# Altium schematic sheet 3V3.SchDoc
size A; SheetNumber: 2
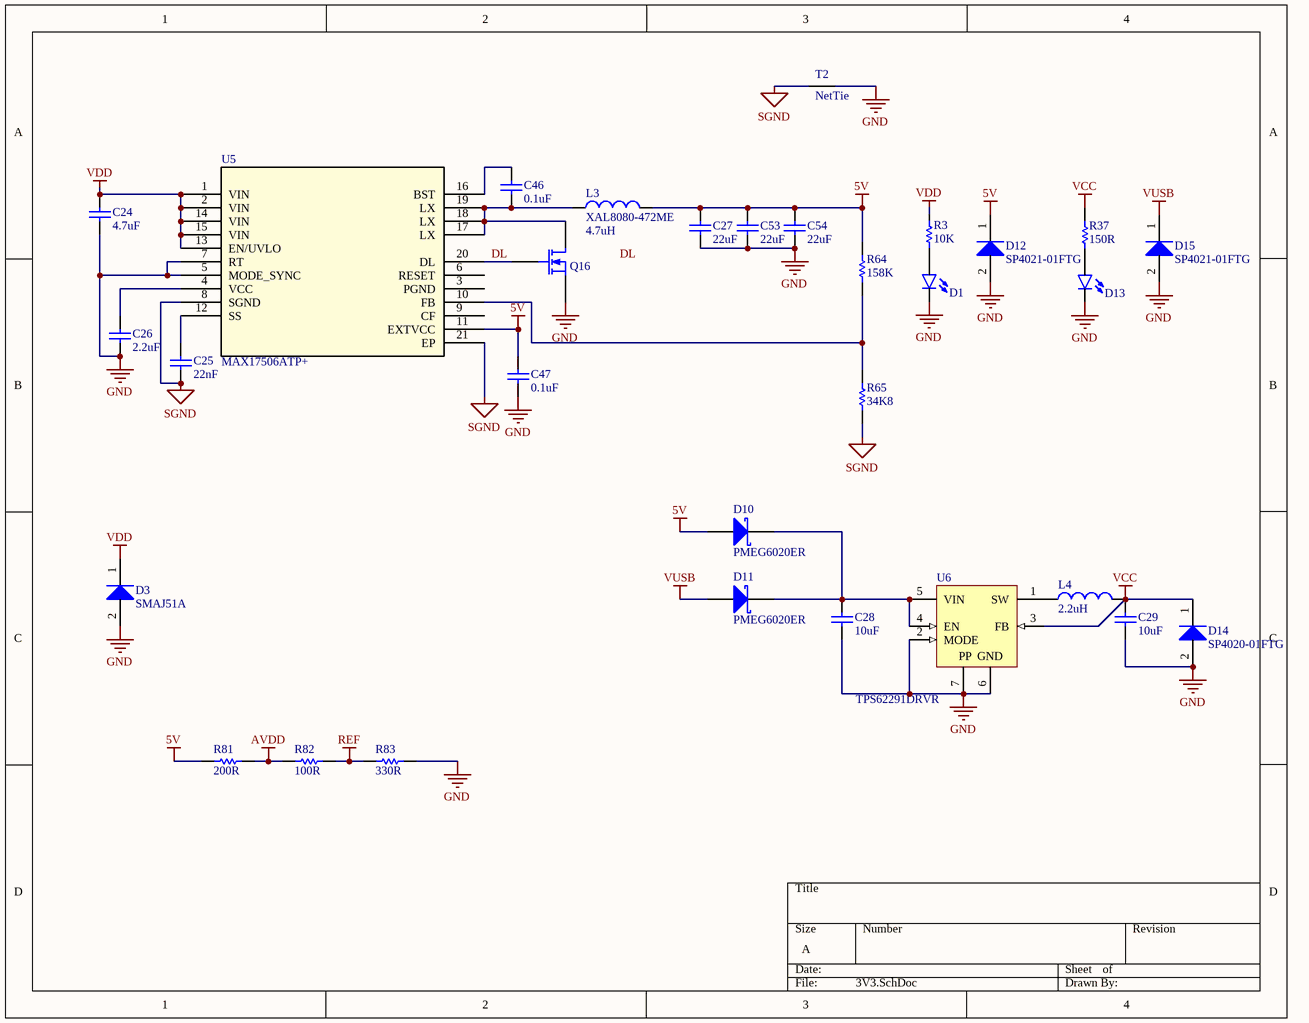
[diagram p0: 3V3.SchDoc]

## Parts
C24  value 4.7uF  [C1210[3225X200]]  (hidden comment: 4.7uF 100V 1210)
C25  value 22nF  [C0603[1608X92]]  (hidden comment: 22nF 50V 0603)
C26  value 2.2uF  [C0603[1608X92]]  (hidden comment: 2.2uF 10V 0603)
C27  value 22uF  [C1210[3225X250]]  (hidden comment: 22uF 16V 1210)
C28  value 10uF  [C0603[1608X92]]  (hidden comment: 10uF 16V 0603)
C29  value 10uF  [C0603[1608X92]]  (hidden comment: 10uF 6.3V 0603)
C46  value 0.1uF  [C0603[1608X92]]  (hidden comment: 0.1uF 16V 0603)
C47  value 0.1uF  [C0603[1608X92]]  (hidden comment: 0.1uF 6.3V 0603)
C53  value 22uF  [C1210[3225X250]]  (hidden comment: 22uF 16V 1210)
C54  value 22uF  [C1210[3225X250]]  (hidden comment: 22uF 16V 1210)
D1  LED_0603_GREEN_5mA  [LED0603]  (value not drawn)
D3  SMAJ51A  [DO-214AC]
D10  PMEG6020ER  [SOD-123]
D11  PMEG6020ER  [SOD-123]
D12  SP4021-01FTG  [SOD-323]
D13  LED_0603_GREEN_5mA  [LED0603]  (value not drawn)
D14  SP4020-01FTG  [SOD-323]
D15  SP4021-01FTG  [SOD-323]
L3  XAL8080-472ME  value 4.7uH  [XAL8080]
L4  2.2uH  [IND0805]
Q16  SIS862DN-T1-GE3  [PowerPak-1212-8]  (value not drawn)
R3  value 10K  [R0603[1608]]  (hidden comment: 10K 1% 0603)
R37  value 150R  [R0603[1608]]  (hidden comment: 150R 1% 0603)
R64  value 158K  [R0603[1608]]  (hidden comment: 158K 1% 0603)
R65  value 34K8  [R0603[1608]]  (hidden comment: 34K8 1% 0603)
R81  value 200R  [R0603[1608]]  (hidden comment: 200R 1% 0603)
R82  value 100R  [R0603[1608]]  (hidden comment: 100R 1% 0603)
R83  value 330R  [R0603[1608]]  (hidden comment: 330R 1% 0603)
T2  NetTie  [NetTie]  (net tie, no BOM)
U5  MAX17506ATP+  [21-0140L_T2055-4]
U6  TPS62291DRVR  [WSON-6]

## Nets
5V: C27.2 C47.2 C53.2 C54.2 D10.2(A) D12.1(K) L3.2 R64.2 R81.1 U5.11(EXTVCC)
AVDD: R81.2 R82.1
GND: C24.1 C26.1 C27.1 C28.1 C29.1 C47.1 C53.1 C54.1 D1.C D3.2(A) D12.2(A) D13.C D14.2(A) D15.2(A) Q16.1(S) R83.2 T2.2 U5.5(MODE_SYNC) U5.7(RT) U6.2(MODE) U6.6(GND) U6.7(EP)
REF: R82.2 R83.1
SGND: C25.1 R65.1 T2.1 U5.8(SGND) U5.21(EP)
VCC: C29.2 D14.1(K) L4.2 R37.2 U6.3(FB)
VDD: C24.2 D3.1(K) R3.2 U5.1(VIN) U5.2(VIN) U5.13(EN/UVLO) U5.14(VIN) U5.15(VIN)
VUSB: D11.2(A) D15.1(K)
DL: Q16.2(G) U5.20(DL)
NetC25_2: C25.2 U5.12(SS)
NetC26_2: C26.2 U5.4(VCC)
NetC28_2: C28.2 D10.1(K) D11.1(K) U6.4(EN) U6.5(VIN)
NetC46_1: C46.1 L3.1 Q16.3(D) U5.17(LX) U5.18(LX) U5.19(LX)
NetC46_2: C46.2 U5.16(BST)
NetD1_A: D1.A R3.1
NetD13_A: D13.A R37.1
NetL4_1: L4.1 U6.1(SW)
NetR64_1: R64.1 R65.2 U5.10(FB)

Not connected (* = marked no-connect by the designer): U5 3(PGND) 6(RESET) 9(CF)

## Notes on the sheet
- Labels drawn without touching a wire or pin: DL
- (in symbol TPS62291DRVR) PP

## Library data of the parts
C24 = CAP_4.7uF_100V_1210_10%: 4.7uF 100V 10% 1210 (3225 Metric); PartNumber: GRJ32DC72A475KE11L; Manufacturer: Murata; Mounting Technology: Surface Mount; PackageReference: 1210; PackageDescription: 1210 (3225 Metric); Voltage: 100V; Tolerance: 10%
C25 = CAP_22nF_50V_0603_10%: 22nF 50V 10% 0603 (1608 Metric); PartNumber: GRM188R71H223KA01D; Manufacturer: Murata; TemperatureCoefficient: X7R; Mounting Technology: Surface Mount; PackageReference: 0603; PackageDescription: 0603 (1608 Metric); Voltage: 50V; Tolerance: 10%
C26 = CAP_2.2uF_10V_0603_10%: 2.2uF 10V 10% 0603 (1608 Metric); PartNumber: GRT188R61A225KE13D; Manufacturer: Murata; TemperatureCoefficient: X5R; Mounting Technology: Surface Mount; PackageReference: 0603; PackageDescription: 0603 (1608 Metric); Voltage: 10V; Tolerance: 10%
C27 C53 C54 = CAP_22uF_16V_1210_20%: 22uF 16V 20% 1210 (3225 Metric); PartNumber: GRM32ER61C476ME15L; Manufacturer: Murata; Mounting Technology: Surface Mount; PackageReference: 1210; PackageDescription: 1210 (3225 Metric); Voltage: 16V; Tolerance: 20%
C28 = CAP_10uF_16V_0603_10%: 10uF 16V 10% 0603 (1608 Metric); PartNumber: GRM188R61C106KAALD; Manufacturer: Murata; TemperatureCoefficient: X5R; Mounting Technology: Surface Mount; PackageReference: 0603; PackageDescription: 0603 (1608 Metric); Voltage: 16V; Tolerance: 10%
C29 = CAP_10uF_6.3V_0603_10%: 10uF 6.3V 10% 0603 (1608 Metric); PartNumber: GRM188R60J106KE47D; Manufacturer: Murata; TemperatureCoefficient: X5R; Mounting Technology: Surface Mount; PackageReference: 0603; PackageDescription: 0603 (1608 Metric); Voltage: 6.3V; Tolerance: 10%
C46 = CAP_0.1uF_16V_0603_10%: 0.1uF 16V 10% 0603 (1608 Metric); PartNumber: GCM188R71C104KA37D; Manufacturer: Murata; TemperatureCoefficient: X7R; Mounting Technology: Surface Mount; PackageReference: 0603; PackageDescription: 0603 (1608 Metric); Voltage: 16V; Tolerance: 10%
C47 = CAP_0.1uF_6.3V_0603_10%: 0.1uF 6.3V 10% 0603 (1608 Metric); PartNumber: GRM188R70J104KA01D; Manufacturer: Murata; Mounting Technology: Surface Mount; PackageReference: 0603; PackageDescription: 0603 (1608 Metric); Voltage: 6.3V; Tolerance: 10%
D1 D13 = LED_0603_GREEN_5mA: PartNumber: LTST-C193TGKT-5A; Manufacturer: Lite-On Inc.; PackageReference: 0603; PackageDescription: 0603 (1608 Metric); Mounting Technology: Surface Mount
D3 = SMAJ51A-E3/61: Manufacturer: Vishay; PartNumber: SMAJ51A-E3/61; PackageReference: DO-214AC; Mounting Technology: Surface Mount; PackageDescription: DO-214AC, 2 Leads
D10 D11 = PMEG6020ER: PartNumber: PMEG6020ER,115; Manufacturer: NXP Semiconductors; PackageReference: SOD-123W; PackageDescription: SOD, 2-Leads, Body 2.69x1.6mm; Mounting Technology: Surface Mount
D12 D15 = SP4021-01FTG: Manufacturer: Littelfuse; PartNumber: SP4021-01FTG; PackageReference: SOD-323-2; Mounting Technology: Surface Mount
D14 = SP4020-01FTG: Manufacturer: Littelfuse; PartNumber: SP4020-01FTG; PackageReference: SOD-323-2; Mounting Technology: Surface Mount
L3 = XAL8080-472ME: 4.7uH 38A 4.08mOhms; PartNumber: XAL8080-472MED; Manufacturer: Coilcraft; Published: 8-Jun-2000; PackageReference: 0402-A; Publisher: Altium Limited; PackageDescription: Chip Inductor
L4 = IND_2.2uH_1.7A_0805_20%: 2.2uH 20% 1.7A 0805; PartNumber: LQM21PN2R2MGHL; Manufacturer: Murata; PackageReference: 0805; PackageDescription: 0805 (2012 metric); Value: 2.2uH; Mounting Technology: Surface Mount; Current: 1.7A
Q16 = SIS862DN-T1-GE3: N-Channel MOSFET; Manufacturer: Vishay; PartNumber: SIS862DN-T1-GE3; Mounting Technology: Surface Mount; PackageReference: PowerPAK-1212-8
R3 = RES_10K_0603_1%: 10K 0.25W 1% 0603 (1005 Metric); Manufacturer: Vishay; PartNumber: RCS060310K0FKEA; Tolerance: 1%; Power: 0.25W; Mounting Technology: Surface Mount; PackageReference: 0603; PackageDescription: 0603 (1608 Metric); ComponentLink1Description: Datasheet; ComponentLink1URL: http://www.vishay.com/docs/20065/rcse3.pdf
R37 = RES_150R_0603_1%: 150R 0.25W 1% 0603 (1005 Metric); Manufacturer: Vishay / Dale; PartNumber: CRCW0603150RFKEAHP; Tolerance: 1%; Power: 0.25W; Mounting Technology: Surface Mount; PackageReference: 0603; PackageDescription: 0603 (1608 Metric); ComponentLink1Description: Datasheet; ComponentLink1URL: http://www.vishay.com/docs/20043/crcwhpe3.pdf
R64 = RES_158K_0603_1%: 158K 0.25W 1% 0603 (1005 Metric); Manufacturer: Vishay / Dale; PartNumber: CRCW0603158KFKEAHP; Tolerance: 1%; Power: 0.25W; Mounting Technology: Surface Mount; PackageReference: 0603; PackageDescription: 0603 (1608 Metric); ComponentLink1Description: Datasheet; ComponentLink1URL: http://www.vishay.com/docs/20043/crcwhpe3.pdf
R65 = RES_34K8_0603_1%: 34K8 0.25W 1% 0603 (1005 Metric); Manufacturer: Vishay / Dale; PartNumber: CRCW060334K8FKEAHP; Tolerance: 1%; Power: 0.25W; Mounting Technology: Surface Mount; PackageReference: 0603; PackageDescription: 0603 (1608 Metric); ComponentLink1Description: Datasheet; ComponentLink1URL: http://www.vishay.com/docs/20043/crcwhpe3.pdf
R81 = RES_200R_0603_1%: 200R 0.25W 1% 0603 (1005 Metric); Manufacturer: Vishay / Dale; PartNumber: CRCW0603200RFKEAHP; Tolerance: 1%; Power: 0.25W; Mounting Technology: Surface Mount; PackageReference: 0603; PackageDescription: 0603 (1608 Metric); ComponentLink1Description: Datasheet; ComponentLink1URL: http://www.vishay.com/docs/20043/crcwhpe3.pdf
R82 = RES_100R_0603_1%: 100R 0.25W 1% 0603 (1005 Metric); Manufacturer: Vishay / Dale; PartNumber: CRCW0603100RFKEAHP; Tolerance: 1%; Power: 0.25W; Mounting Technology: Surface Mount; PackageReference: 0603; PackageDescription: 0603 (1608 Metric); ComponentLink1Description: Datasheet; ComponentLink1URL: http://www.vishay.com/docs/20043/crcwhpe3.pdf
R83 = RES_330R_0603_1%: 330R 0.25W 1% 0603 (1005 Metric); Manufacturer: Vishay / Dale; PartNumber: CRCW0603330RFKEAHP; Tolerance: 1%; Power: 0.25W; Mounting Technology: Surface Mount; PackageReference: 0603; PackageDescription: 0603 (1608 Metric); ComponentLink1Description: Datasheet; ComponentLink1URL: http://www.vishay.com/docs/20043/crcwhpe3.pdf
U5 = MAX17506ATP+: Manufacturer: Maxim; Value: Value; Type: Type; RefDes: RefDes; PartNumber: MAX17506ATP+
U6 = TPS62291DRVR: Voltage Regulators - Switching Regulators 2.25MHz 1A Step-Down Cnvrtr 3.3V Output; Manufacturer: Texas Instruments; PartNumber: TPS62291DRVR; PackageReference: WSON-6; PackageDescription: SON, 6-Leads, Body 2x2mm, Pitch 0.65mm, Thermal Pad 1.6x1mm, TI Recommended; Mounting Technology: Surface Mount